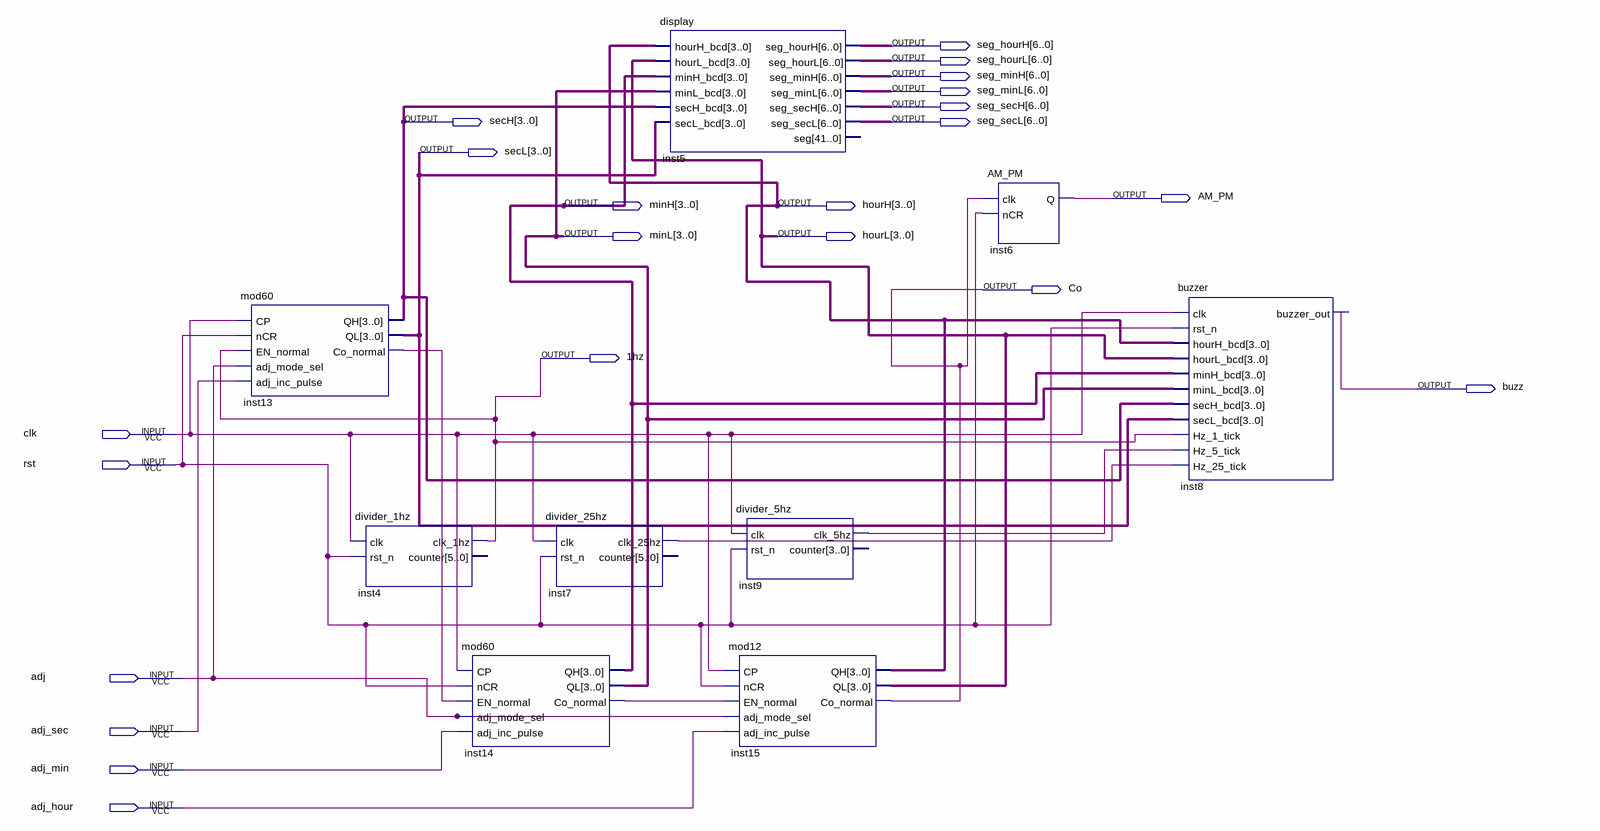
[diagram p0: schematic sheet]
// Quartus schematic final.bdf as structural Verilog: 9 symbols, 22 pins
module \final  (
  input  clk,
  input  rst,
  input  adj,
  input  adj_sec,
  input  adj_min,
  input  adj_hour,
  output [6:0] seg_hourH,
  output [6:0] seg_hourL,
  output [6:0] seg_minH,
  output [6:0] seg_minL,
  output [6:0] seg_secH,
  output [3:0] secH,
  output [6:0] seg_secL,
  output [3:0] secL,
  output AM_PM,
  output [3:0] minH,
  output [3:0] hourH,
  output [3:0] minL,
  output [3:0] hourL,
  output Co,
  output \1hz ,
  output buzz
);

  wire inst7_clk_25hz, inst9_clk_5hz, inst13_co_normal, inst14_co_normal;

  mod60 inst13 (
    .CP(clk), .nCR(rst), .EN_normal(\1hz ), .adj_mode_sel(adj), .adj_inc_pulse(adj_sec), .QH(secH),
    .QL(secL), .Co_normal(inst13_co_normal));
  divider_1hz inst4 (.clk(clk), .rst_n(rst), .clk_1hz(\1hz ));  // open: counter
  mod60 inst14 (
    .CP(clk), .nCR(rst), .EN_normal(inst13_co_normal), .adj_mode_sel(adj), .adj_inc_pulse(adj_min),
    .QH(minH), .QL(minL), .Co_normal(inst14_co_normal));
  divider_25hz inst7 (.clk(clk), .rst_n(rst), .clk_25hz(inst7_clk_25hz));  // open: counter
  display inst5 (
    .hourH_bcd(hourH), .hourL_bcd(hourL), .minH_bcd(minH), .minL_bcd(minL), .secH_bcd(secH), .secL_bcd(secL),
    .seg_hourH(seg_hourH), .seg_hourL(seg_hourL), .seg_minH(seg_minH), .seg_minL(seg_minL),
    .seg_secH(seg_secH), .seg_secL(seg_secL));  // open: seg
  divider_5hz inst9 (.clk(clk), .rst_n(rst), .clk_5hz(inst9_clk_5hz));  // open: counter
  mod12 inst15 (
    .CP(clk), .nCR(rst), .EN_normal(inst14_co_normal), .adj_mode_sel(adj), .adj_inc_pulse(adj_hour),
    .QH(hourH), .QL(hourL), .Co_normal(Co));
  AM_PM inst6 (.clk(Co), .nCR(rst), .Q(AM_PM));
  buzzer inst8 (
    .clk(clk), .rst_n(rst), .hourH_bcd(hourH), .hourL_bcd(hourL), .minH_bcd(minH), .minL_bcd(minL),
    .secH_bcd(secH), .secL_bcd(secL), .Hz_1_tick(\1hz ), .Hz_5_tick(inst9_clk_5hz),
    .Hz_25_tick(inst7_clk_25hz), .buzzer_out(buzz));
endmodule
